# Altium schematic sheet MIXR Input System - Power&Control.SchDoc
size B
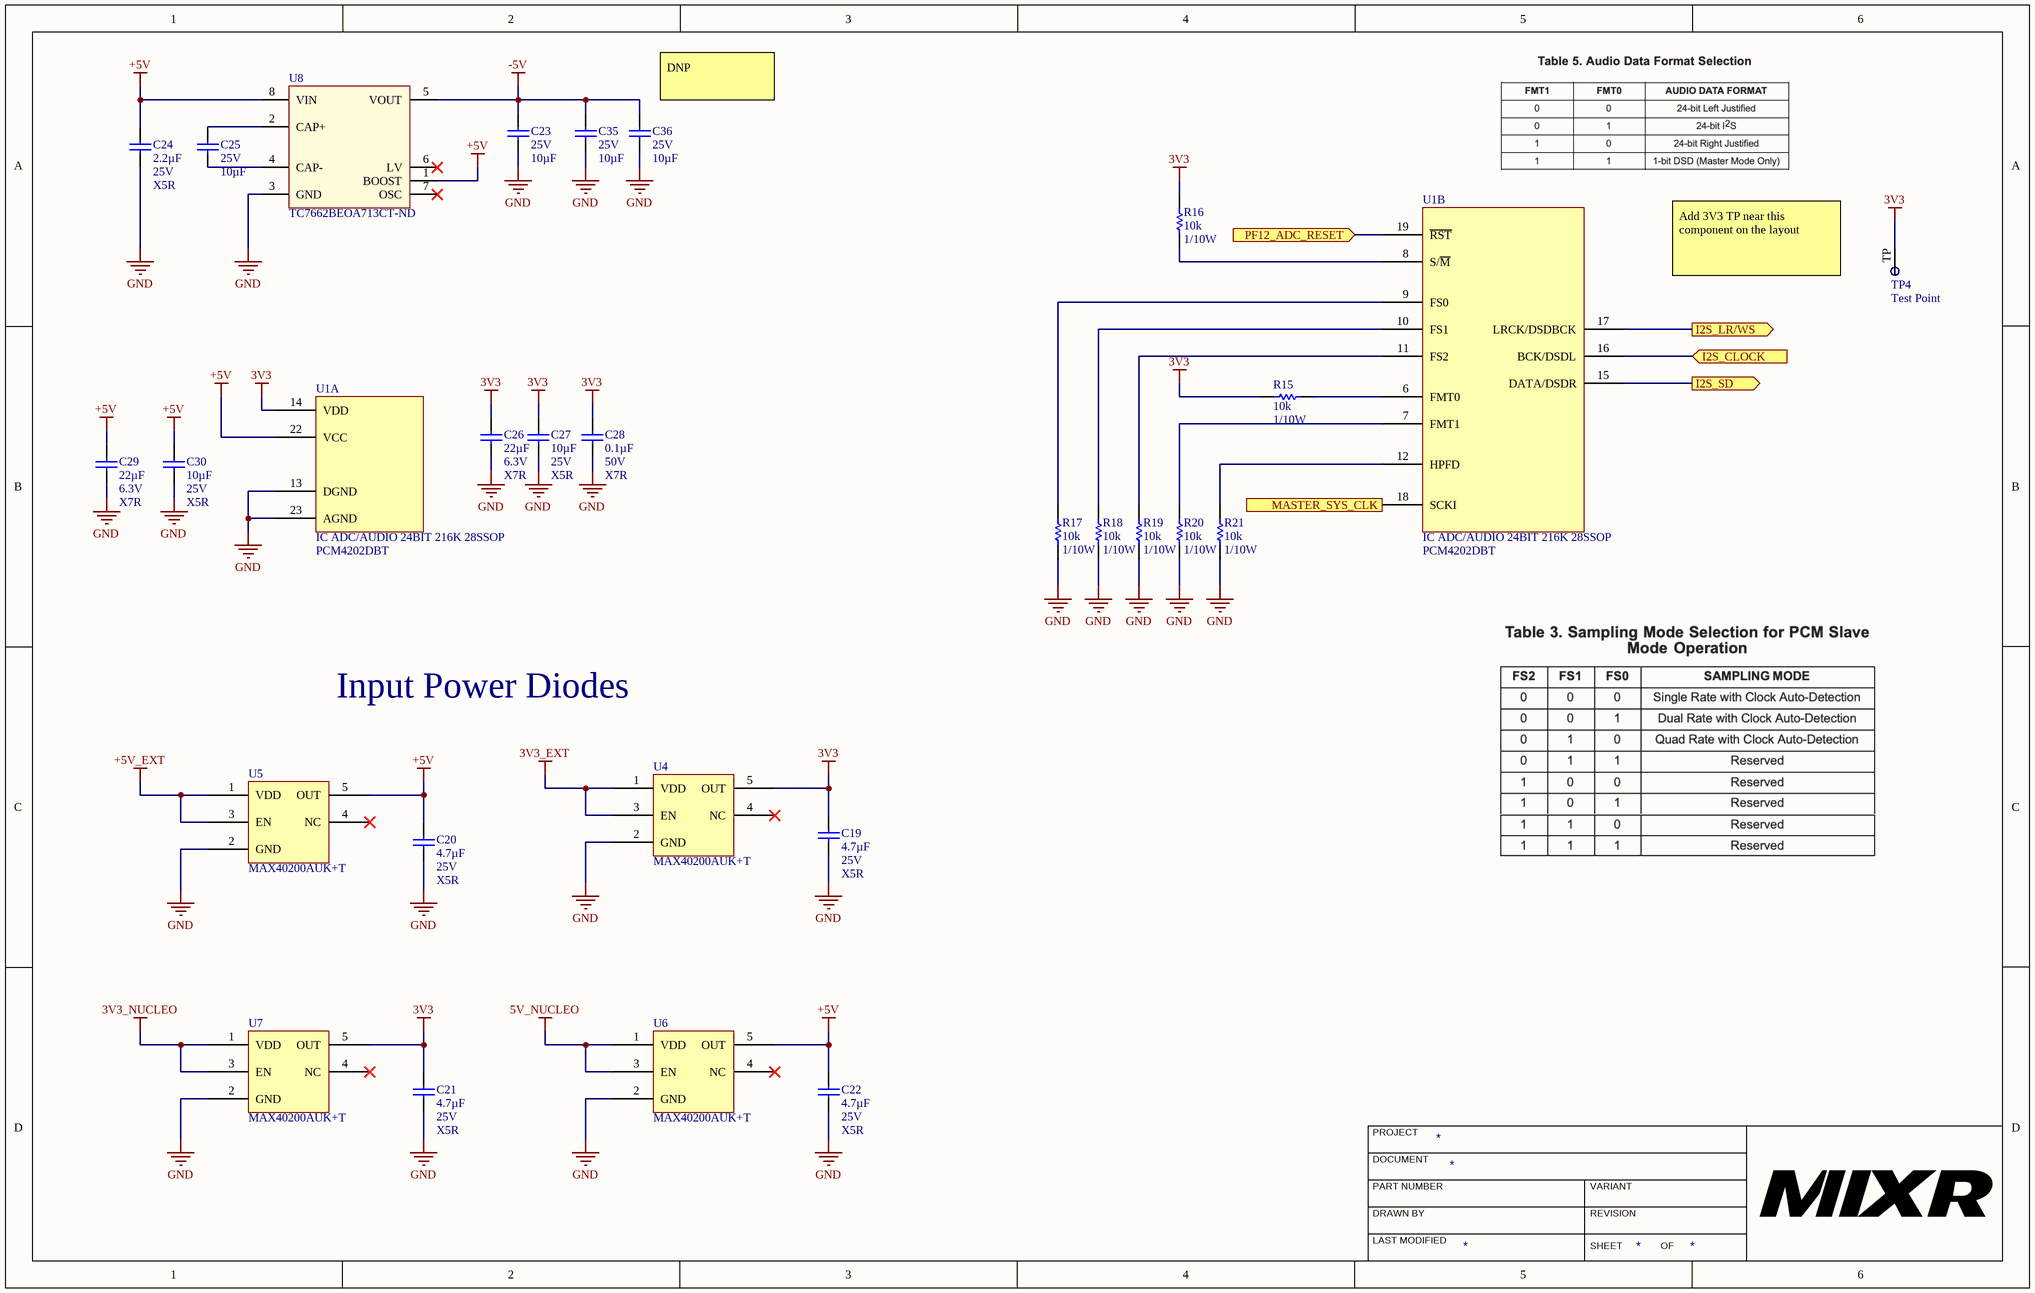
[diagram p0: MIXR Input System - Power&Control.SchDoc]

## Parts
C19  Capacitance: 4.7µF  Voltage: 25V  Temperature Coefficient: X5R  [CAP, 0603]  (hidden comment: CAP CER 4.7UF 25V 10% X5R 0603)
C20  Capacitance: 4.7µF  Voltage: 25V  Temperature Coefficient: X5R  [CAP, 0603]  (hidden comment: CAP CER 4.7UF 25V 10% X5R 0603)
C21  Capacitance: 4.7µF  Voltage: 25V  Temperature Coefficient: X5R  [CAP, 0603]  (hidden comment: CAP CER 4.7UF 25V 10% X5R 0603)
C22  Capacitance: 4.7µF  Voltage: 25V  Temperature Coefficient: X5R  [CAP, 0603]  (hidden comment: CAP CER 4.7UF 25V 10% X5R 0603)
C23  Voltage - Rated: 25V  Capacitance: 10µF  [CAP, 0805]  (hidden comment: CAP CER 10uF 25V 10% X5R 0805)
C24  Capacitance: 2.2µF  Voltage: 25V  Temperature Coefficient: X5R  [CAP, 0603]  (hidden comment: CAP CER 2.2UF 25V 10% X5R 0603)
C25  Voltage - Rated: 25V  Capacitance: 10µF  [CAP, 0805]  (hidden comment: CAP CER 10uF 25V 10% X5R 0805)
C26  Capacitance: 22µF  Voltage: 6.3V  Temperature Coefficient: X7R  [CAP, 1206]  (hidden comment: CAP CER 22UF 6.3V ±10% X7R 1206)
C27  Capacitance: 10µF  Voltage: 25V  Temperature Coefficient: X5R  [CAP, 0603]  (hidden comment: CAP CER 10uF 25V 20% X5R 0603)
C28  Capacitance: 0.1µF  Voltage: 50V  Temperature Coefficient: X7R  [CAP, 0603]  (hidden comment: CAP CER 0.1UF 50V 10% X7R 0603)
C29  Capacitance: 22µF  Voltage: 6.3V  Temperature Coefficient: X7R  [CAP, 1206]  (hidden comment: CAP CER 22UF 6.3V ±10% X7R 1206)
C30  Capacitance: 10µF  Voltage: 25V  Temperature Coefficient: X5R  [CAP, 0603]  (hidden comment: CAP CER 10uF 25V 20% X5R 0603)
C35  Voltage - Rated: 25V  Capacitance: 10µF  [CAP, 0805]  (hidden comment: CAP CER 10uF 25V 10% X5R 0805)
C36  Voltage - Rated: 25V  Capacitance: 10µF  [CAP, 0805]  (hidden comment: CAP CER 10uF 25V 10% X5R 0805)
R15  Resistance: 10k  Power: 1/10W  [RES, 0603]  (hidden comment: RES 10K OHM 1% 1/10W 0603)
R16  Resistance: 10k  Power: 1/10W  [RES, 0603]  (hidden comment: RES 10K OHM 1% 1/10W 0603)
R17  Resistance: 10k  Power: 1/10W  [RES, 0603]  (hidden comment: RES 10K OHM 1% 1/10W 0603)
R18  Resistance: 10k  Power: 1/10W  [RES, 0603]  (hidden comment: RES 10K OHM 1% 1/10W 0603)
R19  Resistance: 10k  Power: 1/10W  [RES, 0603]  (hidden comment: RES 10K OHM 1% 1/10W 0603)
R20  Resistance: 10k  Power: 1/10W  [RES, 0603]  (hidden comment: RES 10K OHM 1% 1/10W 0603)
R21  Resistance: 10k  Power: 1/10W  [RES, 0603]  (hidden comment: RES 10K OHM 1% 1/10W 0603)
TP4  Test Point  [Test Point]  (no BOM)
U1  IC ADC/AUDIO 24BIT 216K 28SSOP  Manufacturer Part Number: PCM4202DBT  [IC ADC 24 BIT AUDIO 216 KHZ SSOP-28]  (parts A,B of 4)
U4  Manufacturer Part Number: MAX40200AUK+T  [SOT95P280X145-5N]  (hidden comment: IC IDEAL DIODE CURRENT SWITCH SOT23-5)
U5  Manufacturer Part Number: MAX40200AUK+T  [SOT95P280X145-5N]  (hidden comment: IC IDEAL DIODE CURRENT SWITCH SOT23-5)
U6  Manufacturer Part Number: MAX40200AUK+T  [SOT95P280X145-5N]  (hidden comment: IC IDEAL DIODE CURRENT SWITCH SOT23-5)
U7  Manufacturer Part Number: MAX40200AUK+T  [SOT95P280X145-5N]  (hidden comment: IC IDEAL DIODE CURRENT SWITCH SOT23-5)
U8  Supplier Part Number 1: TC7662BEOA713CT-ND  (hidden comment: IC REG SWTCHD CAP INV 20MA 8SOIC)

## Ports
I2S_CLOCK (in), I2S_LR/WS (out), I2S_SD (out), MASTER_SYS_CLK (out), PF12_ADC_RESET (in)

## Nets
3V3: C19.1 C21.1 C26.1 C27.1 C28.1 R15.1 R16.1 TP4.TP U1.14(VDD) U4.5(OUT) U7.5(OUT)
3V3_EXT: U4.1(VDD) U4.3(EN)
3V3_NUCLEO: U7.1(VDD) U7.3(EN)
5V_NUCLEO: U6.1(VDD) U6.3(EN)
+5V: C20.1 C22.1 C24.2 C29.1 C30.1 U1.22(VCC) U5.5(OUT) U6.5(OUT) U8.1(BOOST) U8.8(VIN)
+5V_EXT: U5.1(VDD) U5.3(EN)
-5V: C23.1 C35.1 C36.1 U8.5(VOUT)
GND: C19.2 C20.2 C21.2 C22.2 C23.2 C24.1 C26.2 C27.2 C28.2 C29.2 C30.2 C35.2 C36.2 R17.2 R18.2 R19.2 R20.2 R21.2 U1.13(DGND) U1.23(AGND) U4.2(GND) U5.2(GND) U6.2(GND) U7.2(GND) U8.3(GND)
I2S_CLOCK: U1.16(BCK/DSDL) ; port I2S_CLOCK
I2S_LR/WS: U1.17(LRCK/DSDBCK) ; port I2S_LR/WS
I2S_SD: U1.15(DATA/DSDR) ; port I2S_SD
MASTER_SYS_CLK: U1.18(SCKI) ; port MASTER_SYS_CLK
PF12_ADC_RESET: U1.19(~{RST}) ; port PF12_ADC_RESET
NetC25_1: C25.1 U8.2(CAP+)
NetC25_2: C25.2 U8.4(CAP-)
NetR15_2: R15.2 U1.6(FMT0)
NetR16_2: R16.2 U1.8(S/~{M})
NetR17_1: R17.1 U1.9(FS0)
NetR18_1: R18.1 U1.10(FS1)
NetR19_1: R19.1 U1.11(FS2)
NetR20_1: R20.1 U1.7(FMT1)
NetR21_1: R21.1 U1.12(HPFD)

Not connected (* = marked no-connect by the designer): U4 4(NC)*; U5 4(NC)*; U6 4(NC)*; U7 4(NC)*; U8 6(LV)* 7(OSC)*

## Notes on the sheet
- (near C36) DNP
- Add 3V3 TP near this component on the layout
- Input Power Diodes
- PROJECT
- DOCUMENT
- DRAWN BY
- LAST MODIFIED
- PART NUMBER
- REVISION
- SHEET
- VARIANT
- OF

## Library data of the parts
C19-C22 = CAP CER 4.7UF 25V 10% X5R 0603: 4.7µF ±10% 25V Ceramic Capacitor X5R 0603 (1608 Metric); Manufacturer 1: Murata Electronics North America; Manufacturer Part Number 1: GRM188R61E475KE11D; Supplier 1: Digi-Key; Supplier Part Number 1: 490-7203-1-ND; Packaging: Cut Tape (CT); Part Status: Active; Operating Temperature: -55°C ~ 85°C; Ratings: -; Mounting Type: Surface Mount, MLCC; Package / Case: 0603 (1608 Metric); Size / Dimension: 0.063" L x 0.031" W (1.60mm x 0.80mm); Height - Seated (Max): -; Thickness (Max): 0.031" (0.80mm); Lead Spacing: -; Lead Style: -; ComponentLink1URL: http://www.murata.com/~/media/webrenewal/support/library/catalog/products/capacitor/mlcc/c02e.ashx; ComponentLink1Description: http://www.murata.com/~/media/webrenewal/support/library/catalog/products/capacitor/mlcc/c02e.ashx; Tolerance: ±10%
C23 C25 C35 C36 = CAP CER 10uF 25V 10% X5R 0805: 10µF ±10% 25V Ceramic Capacitor X5R 0805 (2012 Metric); Manufacturer: Murata Electronics North America; Manufacturer Part Number: GRM21BR61E106KA73L; Supplier 1: Digi-Key; RoHS: RoHS Compliant; Category: Capacitors; Stock 1: 1695157; Packaging: Cut Tape (CT); Part Status: Active; Tolerance: ±10%; Temperature Coefficient: X5R; Operating Temperature: -55°C ~ 85°C; Features: -; Ratings: -; Applications: General Purpose; Mounting Type: Surface Mount, MLCC; Package / Case: 0805 (2012 Metric); Size / Dimension: 0.079" L x 0.049" W (2.00mm x 1.25mm); Height - Seated (Max): -; Thickness (Max): 0.053" (1.35mm); Lead Spacing: -; Lead Style: -; ComponentLink1URL: http://search.murata.co.jp/Ceramy/image/img/A01X/G101/ENG/GRM21BR61E106KA73-01.pdf; ComponentLink1Description: http://search.murata.co.jp/Ceramy/image/img/A01X/G101/ENG/GRM21BR61E106KA73-01.pdf; Supplier Part Number 1: 490-5523-1-ND; Pricing 1: 1=0.3, 10=0.214, 100=0.1008, 500=0.07068, 1000=0.05851 (CAD)
C24 = CAP CER 2.2UF 25V 10% X5R 0603: 2.2µF ±10% 25V Ceramic Capacitor X5R 0603 (1608 Metric); Manufacturer 1: Murata Electronics North America; Manufacturer Part Number 1: GRM188R61E225KA12D; Supplier 1: Digi-Key; Supplier Part Number 1: 490-10731-1-ND; Packaging: Cut Tape (CT); Part Status: Active; Operating Temperature: -55°C ~ 85°C; Ratings: -; Mounting Type: Surface Mount, MLCC; Package / Case: 0603 (1608 Metric); Size / Dimension: 0.063" L x 0.031" W (1.60mm x 0.80mm); Height - Seated (Max): -; Thickness (Max): 0.035" (0.90mm); Lead Spacing: -; Lead Style: -; ComponentLink1URL: http://www.murata.com/~/media/webrenewal/support/library/catalog/products/capacitor/mlcc/c02e.ashx; ComponentLink1Description: http://www.murata.com/~/media/webrenewal/support/library/catalog/products/capacitor/mlcc/c02e.ashx; Tolerance: ±10%
C26 C29 = CAP CER 22UF 6.3V ±10% X7R 1206: 22µF ±10% 6.3V Ceramic Capacitor X7R 1206 (3216 Metric); Manufacturer 1: Murata Electronics North America; Manufacturer Part Number 1: GRM31CR70J226KE19L; Supplier 1: Digi-Key; Supplier Part Number 1: 490-6515-1-ND; Packaging: Cut Tape (CT); Part Status: Active; Operating Temperature: -55°C ~ 125°C; Ratings: -; Mounting Type: Surface Mount, MLCC; Package / Case: 1206 (3216 Metric); Size / Dimension: 0.126" L x 0.063" W (3.20mm x 1.60mm); Height - Seated (Max): -; Thickness (Max): 0.071" (1.80mm); Lead Spacing: -; Lead Style: -; ComponentLink1URL: http://www.murata.com/~/media/webrenewal/support/library/catalog/products/capacitor/mlcc/c02e.ashx; ComponentLink1Description: http://www.murata.com/~/media/webrenewal/support/library/catalog/products/capacitor/mlcc/c02e.ashx; Tolerance: ±10%
C27 C30 = CAP CER 10uF 25V 20% X5R 0603: 10µF ±20% 25V Ceramic Capacitor X5R 0603 (1608 Metric); Manufacturer 1: Murata Electronics North America; Manufacturer Part Number 1: GRM188R61E106MA73D; Supplier 1: Digi-Key; Supplier Part Number 1: 490-7202-1-ND; Packaging: Cut Tape (CT); Part Status: Active; Operating Temperature: -55°C ~ 85°C; Ratings: -; Mounting Type: Surface Mount, MLCC; Package / Case: 0603 (1608 Metric); Size / Dimension: 0.063" L x 0.031" W (1.60mm x 0.80mm); Height - Seated (Max): -; Thickness (Max): 0.031" (0.80mm); Lead Spacing: -; Lead Style: -; ComponentLink1URL: http://www.murata.com/~/media/webrenewal/support/library/catalog/products/capacitor/mlcc/c02e.ashx; ComponentLink1Description: http://www.murata.com/~/media/webrenewal/support/library/catalog/products/capacitor/mlcc/c02e.ashx; Tolerance: ±20%
C28 = CAP CER 0.1UF 50V 10% X7R 0603: 0.10µF ±10% 50V Ceramic Capacitor X7R 0603 (1608 Metric); Manufacturer 1: AVX Corporation; Manufacturer Part Number 1: 06035C104KAT2A; Supplier 1: Digi-Key; Supplier Part Number 1: 478-5052-1-ND; Packaging: Cut Tape (CT); Part Status: Active; Operating Temperature: -55°C ~ 125°C; Ratings: -; Mounting Type: Surface Mount, MLCC; Package / Case: 0603 (1608 Metric); Size / Dimension: 0.063" L x 0.032" W (1.60mm x 0.81mm); Height - Seated (Max): -; Thickness (Max): 0.035" (0.90mm); Lead Spacing: -; Lead Style: -; ComponentLink1URL: http://datasheets.avx.com/X7RDielectric.pdf; ComponentLink1Description: http://datasheets.avx.com/X7RDielectric.pdf; Tolerance: ±10%
R15-R21 = RES 10K OHM 1% 1/10W 0603: RES SMD 10K OHM 1% 1/10W 0603; Manufacturer 1: Yageo; Manufacturer Part Number 1: RC0603FR-0710KL; Temperature Coefficient: ±100ppm/°C; Supplier 1: Digi-Key; Supplier Part Number 1: 311-10.0KHRCT-ND; Packaging: Cut Tape (CT); Part Status: Active; Composition: Thick Film; Operating Temperature: -55°C ~ 155°C; Package / Case: 0603 (1608 Metric); Supplier Device Package: 0603; Size / Dimension: 0.063" L x 0.031" W (1.60mm x 0.80mm); Height - Seated (Max): 0.022" (0.55mm); Failure Rate: -; ComponentLink1URL: http://www.yageo.com/documents/recent/PYu-RC_Group_51_RoHS_L_7.pdf; ComponentLink1Description: http://www.yageo.com/documents/recent/PYu-RC_Group_51_RoHS_L_7.pdf; Tolerance: ±1%
U1 = IC ADC 24 BIT AUDIO 216KHZ SSOP-28: ADC, Audio 24 bit 216k DSP, PCM 28-SSOP; Manufacturer: Texas Instruments; Operating Supply Voltage: 5V; Interface: Serial; Number of Bits: 24; Sampling Rate: 216KS/s; Number of A/D Converters: 2; Max Power Dissipation: 408mW; Max Supply Voltage: 5.25V; Min Supply Voltage: 4.75V; Nominal Supply Current: 55mA; Power Consumption: 338mW; Resolution: 24b; Polarity: Bipolar; Number of Analog Inputs: 1; Supply Type: Analog; Number of DAC Channels: 0; Supplier 1: Digi-Key; Supplier Part Number 1: 296-17438-1-ND; Stock 1: 5943; Pricing 1: 1 = 9.85000, 10 = 8.89800, 100 = 7.36660 (USD); RoHS: Yes; Mount: Surface Mount; Case/Package: SSOP; Number of Pins: 28; Weight: 0.008529oz; Min Operating Temperature: -10°C; Max Operating Temperature: 70°C; Package Quantity: 250; Packaging: Tape and Reel; Number of Converters: 2; Number of Elements: 2; Power Dissipation: 408mW; Conversion Rate: 216KS/s; Number of ADC Channels: 2; Length: 10.2mm; Height: 1.95mm; Width: 5.3mm; Radiation Hardening: No; Lead Free: Lead Free; REACH SVHC: No SVHC; ComponentLink1URL: https://datasheet.ciiva.com/25988/sbas290b-25988737.pdf?src-supplier=Avnet+Europe; ComponentLink1Description: https://datasheet.ciiva.com/25988/sbas290b-25988737.pdf?src-supplier=Avnet+Europe; ComponentLink2URL: https://datasheet.ciiva.com/41460/001186374-da-01-en-ic-adc-stereo-24b-pcm4202dbt-ssop-28-tid-41460403.pdf?src-supplier=Conrad; ComponentLink2Description: https://datasheet.ciiva.com/41460/001186374-da-01-en-ic-adc-stereo-24b-pcm4202dbt-ssop-28-tid-41460403.pdf?src-supplier=Conrad; ComponentLink3URL: https://datasheet.ciiva.com/26800/pcm4202dbt-26800794.pdf?src-supplier=IIIC; ComponentLink3Description: https://datasheet.ciiva.com/26800/pcm4202dbt-26800794.pdf?src-supplier=IIIC; ComponentLink4URL: https://datasheet.ciiva.com/29896/sbas290b-29896124.pdf?src-supplier=Avnet; ComponentLink4Description: https://datasheet.ciiva.com/29896/sbas290b-29896124.pdf?src-supplier=Avnet; ComponentLink5URL: https://datasheet.ciiva.com/1307/pcm4202-1307121.pdf?src-supplier=Digi-Key; ComponentLink5Description: https://datasheet.ciiva.com/1307/pcm4202-1307121.pdf?src-supplier=Digi-Key; ComponentLink6URL: https://datasheet.ciiva.com/1307/pcm4202-1307122.pdf?src-supplier=Digi-Key; ComponentLink6Description: https://datasheet.ciiva.com/1307/pcm4202-1307122.pdf?src-supplier=Digi-Key; ComponentLink7URL: https://datasheet.ciiva.com/1307/pcm4202-1307123.pdf?src-supplier=Digi-Key; ComponentLink7Description: https://datasheet.ciiva.com/1307/pcm4202-1307123.pdf?src-supplier=Digi-Key; ComponentLink8URL: https://datasheet.ciiva.com/15147/getdatasheetpartid-171631-15147899.pdf?src-supplier=Verical; ComponentLink8Description: https://datasheet.ciiva.com/15147/getdatasheetpartid-171631-15147899.pdf?src-supplier=Verical
U4-U7 = IC IDEAL DIODE CURRENT SWITCH SOT23-5: OR Controller Source Selector Switch P-Channel 1:1 SOT-23-5; Manufacturer: Maxim; Supplier 1: Digi-Key; Supplier Part Number 1: MAX40200AUK+TCT-ND; Stock 1: 7780; Pricing 1: 1 = 0.93000, 10 = 0.82100, 100 = 0.62930, 500 = 0.49750, 1000 = 0.39799 (USD); ComponentLink1Description: Datasheet; ComponentLink1URL: https://datasheets.maximintegrated.com/en/ds/MAX40200.pdf
U8 = IC REG SWTCHD CAP INV 20MA 8SOIC: Charge Pump Switching Regulator IC Positive or Negative Fixed -Vin, 2Vin 1 Output 20mA 8-SOIC (0.154", 3.90mm Width); Manufacturer: Microchip; Manufacturer Part Number: TC7662BEOA713; Number of Outputs: 1; Output Voltage: -15V; Min Supply Voltage: 1.5V; Max Supply Voltage: 15V; Switching Frequency: 35kHz; Synchronous Rectifier: No; Logic Function: Inverting; Output Power: 470mW; Supplier 1: Digi-Key; Stock 1: 59; Pricing 1: 1=2.29, 25=1.9056, 100=1.7304 (USD); Mount: Surface Mount; Case/Package: SOIC; Number of Pins: 8; Weight: 0.006596oz; Min Operating Temperature: -40°C; Max Operating Temperature: 85°C; Package Quantity: 1; Packaging: Tape and Reel; Output Current: 20mA; Max Output Current: 20mA; Max Input Voltage: 15V; Max Output Voltage: -15V; Topology: Charge Pump; Length: 5mm; Height: 1.5mm; Width: 3.99mm; Radiation Hardening: No; Lead Free: Lead Free; ComponentLink1URL: https://datasheet.ciiva.com/2024/21469a-2024368.pdf; ComponentLink1Description: https://datasheet.ciiva.com/2024/21469a-2024368.pdf; ComponentLink2URL: https://datasheet.ciiva.com/2024/filehandler-aspxddocname-en026002-2024369.pdf; ComponentLink2Description: https://datasheet.ciiva.com/2024/filehandler-aspxddocname-en026002-2024369.pdf; ComponentLink3URL: https://datasheet.ciiva.com/16295/filehandler-aspxddocname-en011347-16295442.pdf; ComponentLink3Description: https://datasheet.ciiva.com/16295/filehandler-aspxddocname-en011347-16295442.pdf; ComponentLink4URL: https://datasheet.ciiva.com/3216/cn-21469a-3216331.pdf; ComponentLink4Description: https://datasheet.ciiva.com/3216/cn-21469a-3216331.pdf; ComponentLink5URL: https://datasheet.ciiva.com/18553/filehandler-aspxddocname-en026002-18553038.pdf; ComponentLink5Description: https://datasheet.ciiva.com/18553/filehandler-aspxddocname-en026002-18553038.pdf; ComponentLink6URL: https://datasheet.ciiva.com/4875/21469a-4875151.pdf; ComponentLink6Description: https://datasheet.ciiva.com/4875/21469a-4875151.pdf